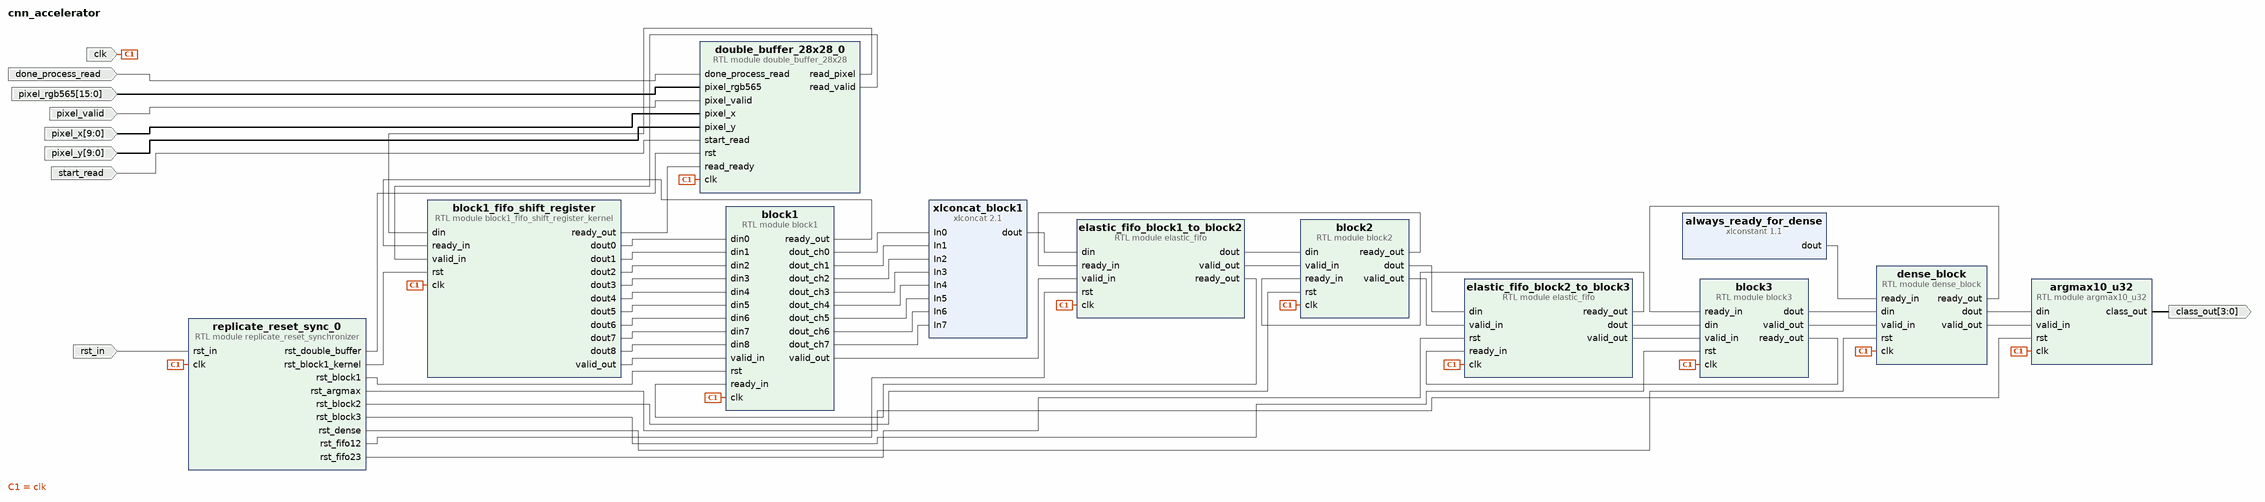
[diagram p0: block diagram of the top level]
# Vivado block design cnn_accelerator, xc7a100tcsg324-1, Vivado 2025.2
create_bd_design cnn_accelerator

create_bd_port -dir I -from 15 -to 0 pixel_rgb565
create_bd_port -dir I pixel_valid
create_bd_port -dir I -from 9 -to 0 pixel_y
create_bd_port -dir I -from 9 -to 0 pixel_x
create_bd_port -dir I start_read
create_bd_port -dir I done_process_read
create_bd_port -dir I -type clk clk
set_property -dict {CONFIG.FREQ_HZ 100000000} [get_bd_ports clk]
create_bd_port -dir O -from 3 -to 0 class_out
create_bd_port -dir I rst_in

create_bd_cell -type module -reference double_buffer_28x28 double_buffer_28x28_0
create_bd_cell -type module -reference block1_fifo_shift_register_kernel block1_fifo_shift_register
create_bd_cell -type module -reference block1 block1
create_bd_cell -type ip -vlnv xilinx.com:ip:xlconcat:2.1 xlconcat_block1
set_property -dict [list \
  CONFIG.IN0_WIDTH 32 \
  CONFIG.IN1_WIDTH 32 \
  CONFIG.IN2_WIDTH 32 \
  CONFIG.IN3_WIDTH 32 \
  CONFIG.IN4_WIDTH 32 \
  CONFIG.IN5_WIDTH 32 \
  CONFIG.IN6_WIDTH 32 \
  CONFIG.IN7_WIDTH 32 \
  CONFIG.NUM_PORTS 8 \
] [get_bd_cells xlconcat_block1]
create_bd_cell -type module -reference elastic_fifo elastic_fifo_block1_to_block2
set_property -dict {CONFIG.DEPTH 120} [get_bd_cells elastic_fifo_block1_to_block2]
create_bd_cell -type module -reference block2 block2
create_bd_cell -type module -reference elastic_fifo elastic_fifo_block2_to_block3
set_property -dict {CONFIG.DATA_WIDTH 512 CONFIG.DEPTH 12} [get_bd_cells elastic_fifo_block2_to_block3]
create_bd_cell -type module -reference block3 block3
set_property -dict {CONFIG.GROUP_CHANNELS 4} [get_bd_cells block3]
create_bd_cell -type module -reference dense_block dense_block
create_bd_cell -type module -reference argmax10_u32 argmax10_u32
create_bd_cell -type ip -vlnv xilinx.com:ip:xlconstant:1.1 always_ready_for_dense
create_bd_cell -type module -reference replicate_reset_synchronizer replicate_reset_sync_0

# ---- connections ----

connect_bd_net [get_bd_pins argmax10_u32/class_out] [get_bd_ports class_out]
connect_bd_net -net block1_0_dout_ch0 [get_bd_pins block1/dout_ch0] [get_bd_pins xlconcat_block1/In0]
connect_bd_net -net block1_0_dout_ch1 [get_bd_pins block1/dout_ch1] [get_bd_pins xlconcat_block1/In1]
connect_bd_net -net block1_0_dout_ch2 [get_bd_pins block1/dout_ch2] [get_bd_pins xlconcat_block1/In2]
connect_bd_net -net block1_0_dout_ch3 [get_bd_pins block1/dout_ch3] [get_bd_pins xlconcat_block1/In3]
connect_bd_net -net block1_0_dout_ch4 [get_bd_pins block1/dout_ch4] [get_bd_pins xlconcat_block1/In4]
connect_bd_net -net block1_0_dout_ch5 [get_bd_pins block1/dout_ch5] [get_bd_pins xlconcat_block1/In5]
connect_bd_net -net block1_0_dout_ch6 [get_bd_pins block1/dout_ch6] [get_bd_pins xlconcat_block1/In6]
connect_bd_net -net block1_0_dout_ch7 [get_bd_pins block1/dout_ch7] [get_bd_pins xlconcat_block1/In7]
connect_bd_net -net block1_0_ready_out [get_bd_pins block1/ready_out] [get_bd_pins block1_fifo_shift_register/ready_in]
connect_bd_net -net block1_0_valid_out [get_bd_pins block1/valid_out] [get_bd_pins elastic_fifo_block1_to_block2/valid_in]
connect_bd_net -net block1_fifo_shift_re_0_dout0 [get_bd_pins block1_fifo_shift_register/dout0] [get_bd_pins block1/din0]
connect_bd_net -net block1_fifo_shift_re_0_dout1 [get_bd_pins block1_fifo_shift_register/dout1] [get_bd_pins block1/din1]
connect_bd_net -net block1_fifo_shift_re_0_dout2 [get_bd_pins block1_fifo_shift_register/dout2] [get_bd_pins block1/din2]
connect_bd_net -net block1_fifo_shift_re_0_dout3 [get_bd_pins block1_fifo_shift_register/dout3] [get_bd_pins block1/din3]
connect_bd_net -net block1_fifo_shift_re_0_dout4 [get_bd_pins block1_fifo_shift_register/dout4] [get_bd_pins block1/din4]
connect_bd_net -net block1_fifo_shift_re_0_dout5 [get_bd_pins block1_fifo_shift_register/dout5] [get_bd_pins block1/din5]
connect_bd_net -net block1_fifo_shift_re_0_dout6 [get_bd_pins block1_fifo_shift_register/dout6] [get_bd_pins block1/din6]
connect_bd_net -net block1_fifo_shift_re_0_dout7 [get_bd_pins block1_fifo_shift_register/dout7] [get_bd_pins block1/din7]
connect_bd_net -net block1_fifo_shift_re_0_dout8 [get_bd_pins block1_fifo_shift_register/dout8] [get_bd_pins block1/din8]
connect_bd_net -net block1_fifo_shift_re_0_ready_out [get_bd_pins block1_fifo_shift_register/ready_out] [get_bd_pins double_buffer_28x28_0/read_ready]
connect_bd_net -net block1_fifo_shift_re_0_valid_out [get_bd_pins block1_fifo_shift_register/valid_out] [get_bd_pins block1/valid_in]
connect_bd_net -net block2_0_dout [get_bd_pins block2/dout] [get_bd_pins elastic_fifo_block2_to_block3/din]
connect_bd_net -net block2_0_ready_out [get_bd_pins block2/ready_out] [get_bd_pins elastic_fifo_block1_to_block2/ready_in]
connect_bd_net -net block2_0_valid_out [get_bd_pins block2/valid_out] [get_bd_pins elastic_fifo_block2_to_block3/valid_in]
connect_bd_net -net block3_0_dout [get_bd_pins block3/dout] [get_bd_pins dense_block/din]
connect_bd_net [get_bd_pins block3/ready_out] [get_bd_pins elastic_fifo_block2_to_block3/ready_in]
connect_bd_net [get_bd_pins block3/valid_out] [get_bd_pins dense_block/valid_in]
connect_bd_net -net dense_block_0_dout [get_bd_pins dense_block/dout] [get_bd_pins argmax10_u32/din]
connect_bd_net [get_bd_pins dense_block/ready_out] [get_bd_pins block3/ready_in]
connect_bd_net [get_bd_pins dense_block/valid_out] [get_bd_pins argmax10_u32/valid_in]
connect_bd_net -net done_process_read_0_1 [get_bd_ports done_process_read] [get_bd_pins double_buffer_28x28_0/done_process_read]
connect_bd_net [get_bd_pins double_buffer_28x28_0/read_pixel] [get_bd_pins block1_fifo_shift_register/din]
connect_bd_net [get_bd_pins double_buffer_28x28_0/read_valid] [get_bd_pins block1_fifo_shift_register/valid_in]
connect_bd_net -net elastic_fifo_0_dout [get_bd_pins elastic_fifo_block1_to_block2/dout] [get_bd_pins block2/din]
connect_bd_net -net elastic_fifo_0_ready_out [get_bd_pins elastic_fifo_block1_to_block2/ready_out] [get_bd_pins block1/ready_in]
connect_bd_net -net elastic_fifo_0_valid_out [get_bd_pins elastic_fifo_block1_to_block2/valid_out] [get_bd_pins block2/valid_in]
connect_bd_net [get_bd_pins elastic_fifo_block2_to_block3/dout] [get_bd_pins block3/din]
connect_bd_net [get_bd_pins elastic_fifo_block2_to_block3/ready_out] [get_bd_pins block2/ready_in]
connect_bd_net [get_bd_pins elastic_fifo_block2_to_block3/valid_out] [get_bd_pins block3/valid_in]
connect_bd_net -net pixel_rgb565_0_1 [get_bd_ports pixel_rgb565] [get_bd_pins double_buffer_28x28_0/pixel_rgb565]
connect_bd_net -net pixel_valid_0_1 [get_bd_ports pixel_valid] [get_bd_pins double_buffer_28x28_0/pixel_valid]
connect_bd_net -net pixel_x_0_1 [get_bd_ports pixel_x] [get_bd_pins double_buffer_28x28_0/pixel_x]
connect_bd_net -net pixel_y_0_1 [get_bd_ports pixel_y] [get_bd_pins double_buffer_28x28_0/pixel_y]
connect_bd_net [get_bd_pins replicate_reset_sync_0/rst_argmax] [get_bd_pins argmax10_u32/rst]
connect_bd_net [get_bd_pins replicate_reset_sync_0/rst_block1] [get_bd_pins block1/rst]
connect_bd_net [get_bd_pins replicate_reset_sync_0/rst_block1_kernel] [get_bd_pins block1_fifo_shift_register/rst]
connect_bd_net [get_bd_pins replicate_reset_sync_0/rst_block2] [get_bd_pins block2/rst]
connect_bd_net [get_bd_pins replicate_reset_sync_0/rst_block3] [get_bd_pins block3/rst]
connect_bd_net [get_bd_pins replicate_reset_sync_0/rst_dense] [get_bd_pins dense_block/rst]
connect_bd_net [get_bd_pins replicate_reset_sync_0/rst_double_buffer] [get_bd_pins double_buffer_28x28_0/rst]
connect_bd_net [get_bd_pins replicate_reset_sync_0/rst_fifo12] [get_bd_pins elastic_fifo_block1_to_block2/rst]
connect_bd_net [get_bd_pins replicate_reset_sync_0/rst_fifo23] [get_bd_pins elastic_fifo_block2_to_block3/rst]
connect_bd_net -net rst_in_0_1 [get_bd_ports rst_in] [get_bd_pins replicate_reset_sync_0/rst_in]
connect_bd_net -net start_read_0_1 [get_bd_ports start_read] [get_bd_pins double_buffer_28x28_0/start_read]
connect_bd_net -net util_ds_buf_0_BUFG_O [get_bd_ports clk] \
  [get_bd_pins elastic_fifo_block2_to_block3/clk] [get_bd_pins elastic_fifo_block1_to_block2/clk] \
  [get_bd_pins dense_block/clk] [get_bd_pins replicate_reset_sync_0/clk] [get_bd_pins argmax10_u32/clk] \
  [get_bd_pins block1/clk] [get_bd_pins block1_fifo_shift_register/clk] [get_bd_pins block2/clk] [get_bd_pins block3/clk] \
  [get_bd_pins double_buffer_28x28_0/clk]
connect_bd_net -net xlconcat_0_dout [get_bd_pins xlconcat_block1/dout] [get_bd_pins elastic_fifo_block1_to_block2/din]
connect_bd_net -net xlconstant_0_dout [get_bd_pins always_ready_for_dense/dout] [get_bd_pins dense_block/ready_in]

validate_bd_design
save_bd_design
